# Altium schematic sheet southside.schdoc: South Side Connector
size 431 x 279 mm; DrawnBy: D. Bruey, M. Ciuffo; Organization: Synapse Product Development, LLC.; Address1: 1511 6th Ave., Suite 400; Address2: Seattle, Washington 98101; Address3: 206.381.0898; Address4: www.synapse.com; DocumentNumber: 12; SheetNumber: 3; SheetTotal: 7; PageSetup: Record=PageOptions|CenterHorizontal=True|CenterVertical=True|PrintScale=0.95|XCorrection=1.00|YCorrection=1.00|PrintKind=1|BorderSize=5000000|LeftOffset=0|BottomOffset=0|Orientation=2|PaperLength=4318|PaperWidth=2794|Scale=100|PaperSource=7|PrintQuality=200|MediaType=1|DitherType=10|PrintScaleMode=1|PaperKind=11x17|PaperIndex=3
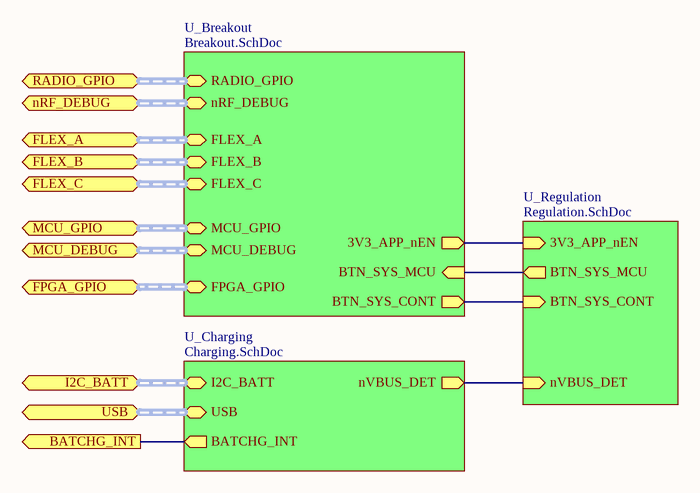
[diagram p0: southside.schdoc]

## Sub-sheets
U_Breakout = Breakout.SchDoc: FLEX_A (harness SPI), FLEX_B (harness SPI), FLEX_C (harness SPI), MCU_GPIO (harness MCU_IO), MCU_DEBUG (harness SWD), FPGA_GPIO (harness FPGA_IO), nRF_DEBUG (harness SWD), RADIO_GPIO (harness RADIO_IO), BTN_SYS_CONT (out), BTN_SYS_MCU (in), 3V3_APP_nEN (out)
U_Charging = Charging.SchDoc: I2C_BATT (harness I2C), USB (harness USB), BATCHG_INT (out), nVBUS_DET (out)
U_Regulation = Regulation.SchDoc: nVBUS_DET (in), BTN_SYS_CONT (in), BTN_SYS_MCU (out), 3V3_APP_nEN (in)

## Ports
BATCHG_INT (out), FLEX_A (harness SPI), FLEX_B (harness SPI), FLEX_C (harness SPI), FPGA_GPIO (harness FPGA_IO), I2C_BATT (harness I2C), MCU_DEBUG (harness SWD), MCU_GPIO (harness MCU_IO), nRF_DEBUG (harness SWD), RADIO_GPIO (harness RADIO_IO), USB (harness USB)

## Nets
BATCHG_INT: port BATCHG_INT, sheet U_Charging/BATCHG_INT
(unnamed): sheet U_Charging/nVBUS_DET, sheet U_Regulation/nVBUS_DET
(unnamed): sheet U_Regulation/BTN_SYS_CONT, sheet U_Breakout/BTN_SYS_CONT
(unnamed): sheet U_Regulation/BTN_SYS_MCU, sheet U_Breakout/BTN_SYS_MCU
(unnamed): sheet U_Regulation/3V3_APP_nEN, sheet U_Breakout/3V3_APP_nEN

## Buses and harness runs
harness port FLEX_A = sheet U_Breakout/FLEX_A
harness port FLEX_B = sheet U_Breakout/FLEX_B
harness port FLEX_C = sheet U_Breakout/FLEX_C
harness port FPGA_GPIO = sheet U_Breakout/FPGA_GPIO
harness port I2C_BATT = sheet U_Charging/I2C_BATT
harness port MCU_DEBUG = sheet U_Breakout/MCU_DEBUG
harness port MCU_GPIO = sheet U_Breakout/MCU_GPIO
harness port nRF_DEBUG = sheet U_Breakout/nRF_DEBUG
harness port RADIO_GPIO = sheet U_Breakout/RADIO_GPIO
harness port USB = sheet U_Charging/USB

## Notes on the sheet
- Design Notes:
- Layout Notes:
- Project:
- Sheet Title:
- PCBA:
- PROPRIETARY AND CONFIDENTIAL
- Drawn by:
- Schematic Part Number:
- Schematic Revision:
- Date:
- Sheet:
- /